# Altium schematic sheet System Power.SchDoc
size 297 x 209 mm; CompanyName: Sainsbury Wellcome Centre; Organization: FabLab; Address1: Sainsbury Wellcome Centre; Address2: 25 Howland Street; Address3: London; Address4: W1T 4JG; DocumentNumber: 3; SheetNumber: 3; SheetTotal: 14; swcgroup: FabLab; Org: Sainsbury Wellcome Centre; Add1: 25 Howland Street; Add2: London; Add3: W1T 4JG; WebAddress: www.sainsburywellcome.org; SheetSize: A4; SheetName: System Power
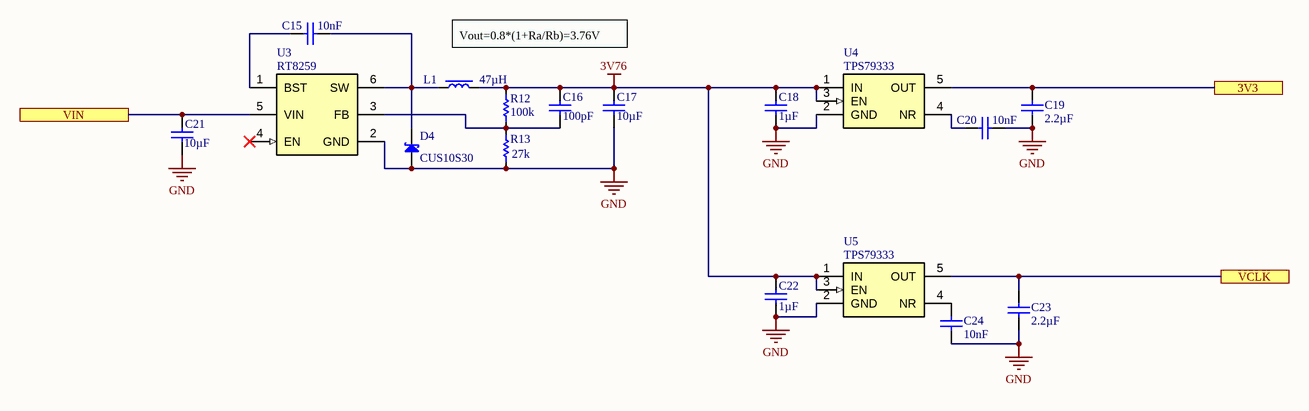
[diagram p0: System Power.SchDoc]

## Parts
C15  value 10nF  [CAP_CHIP_0603]  (hidden comment: C0603-10nF-50V)
C16  value 100pF  [CAP_CHIP_0603]  (hidden comment: C0603-100pF-50V)
C17  value 10µF  [CAP_CHIP_0603]  (hidden comment: C0603-10uF-35V)
C18  value 1µF  [CAP_CHIP_0603]  (hidden comment: C0603-1uF-50V)
C19  value 2.2µF  [CAP_CHIP_0603]  (hidden comment: C0603-2.2uF-50V)
C20  value 10nF  [CAP_CHIP_0603]  (hidden comment: C0603-10nF-100V)
C21  value 10µF  [CAP_CHIP_0603]  (hidden comment: C0603-10uF-35V)
C22  value 1µF  [CAP_CHIP_0603]  (hidden comment: C0603-1uF-50V)
C23  value 2.2µF  [CAP_CHIP_0603]  (hidden comment: C0603-2.2uF-50V)
C24  value 10nF  [CAP_CHIP_0603]  (hidden comment: C0603-10nF-100V)
D4  CUS10S30  [SOD323]
L1  value 47µH  [IND_PWR_1210]  (hidden comment: L-PWR-47uH-0.3A)
R12  value 100k  [RES_CHIP_0603]  (hidden comment: R0603-100K)
R13  value 27k  [RES_CHIP_0603]  (hidden comment: R0603-27K)
U3  RT8259  [SOT23-6]
U4  TPS79333  [SOT23-5]
U5  TPS79333  [SOT23-5]

## Ports
3V3, VCLK, VIN

## Nets
3V76: C16.2 C17.2 C18.2 C22.2 L1.2 R12.2 U4.1(IN) U4.3(EN) U5.1(IN) U5.3(EN)
GND: C17.1 C18.1 C19.1 C20.1 C21.1 C22.1 C23.1 C24.1 D4.2(A) R13.1 U3.2(GND) U4.2(GND) U5.2(GND)
3V3: C19.2 U4.5(OUT) ; port 3V3
VCLK: C23.2 U5.5(OUT) ; port VCLK
VIN: C21.2 U3.5(VIN) ; port VIN
NetC15_1: C15.1 D4.1(C) L1.1 U3.6(SW)
NetC15_2: C15.2 U3.1(BST)
NetC16_1: C16.1 R12.1 R13.2 U3.3(FB)
NetC20_2: C20.2 U4.4(NR)
NetC24_2: C24.2 U5.4(NR)

Not connected (* = marked no-connect by the designer): U3 4(EN)*

## Notes on the sheet
- Vout=0.8*(1+Ra/Rb)=3.76V
- FILE
- VARIANT
- DATE
- REVISION
- SHEET
- /
- PROJECT
- SIZE

## Library data of the parts
C15 = CMP-611-0022-7: 0603 Multilayer Ceramic Capacitors MLCC; PartNumber: 0603B103K500NT; Tolerance: 10%; Voltage Rating: 50V; Pick&PlaceFootprint: C0603; Dielectric: X7R; RoHS: Yes; Capacitor Type: Ceramic; Mount: SMD; Case/Package: 0603; LCSC Part N.: C57112
C16 = CMP-611-0038-6: 0603 Multilayer Ceramic Capacitors MLCC; PartNumber: CL10C101JB8NNNC; Pick&PlaceFootprint: C0603; Tolerance: 5%; Voltage Rating: 50V; Dielectric: C0G; Case/Package: 0603; LCSC Part N.: C14858; Capacitor Type: Ceramic; Mount: SMD; RoHS: Yes
C17 C21 = CMP-611-0048-3: Ceramic Capacitor, Multilayer, Ceramic, 35V, 20% +Tol, 20% -Tol, X5R, 15% TC, 10uF, Surface Mount, 0603; PartNumber: GRM188R6YA106MA73D; Pick&PlaceFootprint: C0603; Dielectric: X5R; Capacitor Type: Ceramic; Mount: SMD; LCSC Part N.: C194427; RoHS: Yes; Tolerance: 20%; Voltage Rating: 35V; Case/Package: 0603
C18 C22 = CMP-611-0033-11: 0603 Multilayer Ceramic Capacitors MLCC; PartNumber: CL10A105KB8NNNC; Pick&PlaceFootprint: C0603; Voltage Rating: 50V; Dielectric: X5R; Tolerance: 10%; Case/Package: 0603; LCSC Part N.: C15849; RoHS: Yes; Mount: SMD; Capacitor Type: Ceramic
C19 C23 = CMP-611-0060-3: 0603 Multilayer Ceramic Capacitors MLCC; PartNumber: GRM188R61H225KE11D; Pick&PlaceFootprint: C0603; Voltage Rating: 50V; Dielectric: X5R; Tolerance: 10%; Mount: SMD; LCSC Part N.: C162273; Capacitor Type: Ceramic; Case/Package: 0603; RoHS: Yes
C20 C24 = CMP-611-0030-11: 0603 Multilayer Ceramic Capacitors MLCC; PartNumber: CL10B103KC84PEL; Tolerance: 10%; Voltage Rating: 100V; Dielectric: X7R; Pick&PlaceFootprint: C0603; LCSC Part N.: C525730; Case/Package: 0603; Capacitor Type: Ceramic; Mount: SMD; RoHS: Yes
D4 = CMP-821-0013-3: Rectifier Diode, Schottky, 1 Phase, 1 Element, 1A, 30V V(RRM), Silicon; PartNumber: CUS10S30,H3F; Forward Voltage: 370mV; LCSC Part N.: C146335; Max Reverse Voltage: 30V; Mount: Surface Mount; Pick&PlaceFootprint: SOD323; Forward Current: 1A
L1 = CMP-620-0005-6: Inductor Power Chip Shielded Wirewound 47uH 20% 1MHz Ferrite 0.5A 0.9Ohm DCR 1210 Automotive T/R; PartNumber: LQW32FT470M0HL; RMS Current (Irms): 500mA; Saturation Current: 300mA; DC Resistance (DCR): 900mR; Tolerance: 20%; LCSC Part N.: C907956
R12 = CMP-633-0000-28: 100mW Thick Film Resistors 75V ±100ppm/℃ ±1% 0603 Chip Resistor; PartNumber: 0603WAF1003T5E; Number of Resistors: 1; Pick&PlaceFootprint: R0603; LCSC Part N.: C25803; Mount: Surface Mount; Voltage Rating: 75V; Power Rating: 100mW; Case/Package: 0603; Tolerance: 1%
R13 = CMP-633-0124-2: 100mW Thick Film Resistors 75V ±100ppm/℃ ±1% 0603 Chip Resistor; PartNumber: 0603WAF2702T5E; Pick&PlaceFootprint: R0603; Number of Resistors: 1; Tolerance: 1%; Case/Package: 0603; Mount: Surface Mount; Voltage Rating: 75V; Power Rating: 100mW; LCSC Part N.: C22967
U3 = CMP-970-0044-2: Step-down type Adjustable 800mV~15V 1.2A 4.5V~24V Switching Regulator/Controller; PartNumber: RT8259GJ6; Min Input Voltage: 4.5V; RDS(On): 300mR; Reference Voltage: 0.8V; Switcher Configuration: BUCK; Switching Frequency: 1.4MHz; Max Input Voltage: 24V; Max Output Voltage: 15V; LCSC Part N.: C425775; Pick&PlaceFootprint: SOT23-6; Max Output current: 1.2A
U4 U5 = CMP-970-0017-6: LDO Regulator Pos 3.3V 0.2A 5-Pin SOT-23-5 200mA; PartNumber: TPS79333DBVR; Max Input Voltage: 5.5V; Dropout Voltage: 102mV; Line Regulation: 0.05%; Quiescent Current: 170uA; PSRR: 70dB; Output Noise: 32uV; Accuracy: 2%; Output Type: Fixed; Load Regulation: 0.03%; LCSC Part N.: C9840; Pick&PlaceFootprint: SOT23-5; Output Voltage: 3.3V; Max Output Current: 200mA